# Altium schematic sheet Quadrature Mixers [FIXED].SchDoc
size A; SheetNumber: 6; SheetTotal: 6
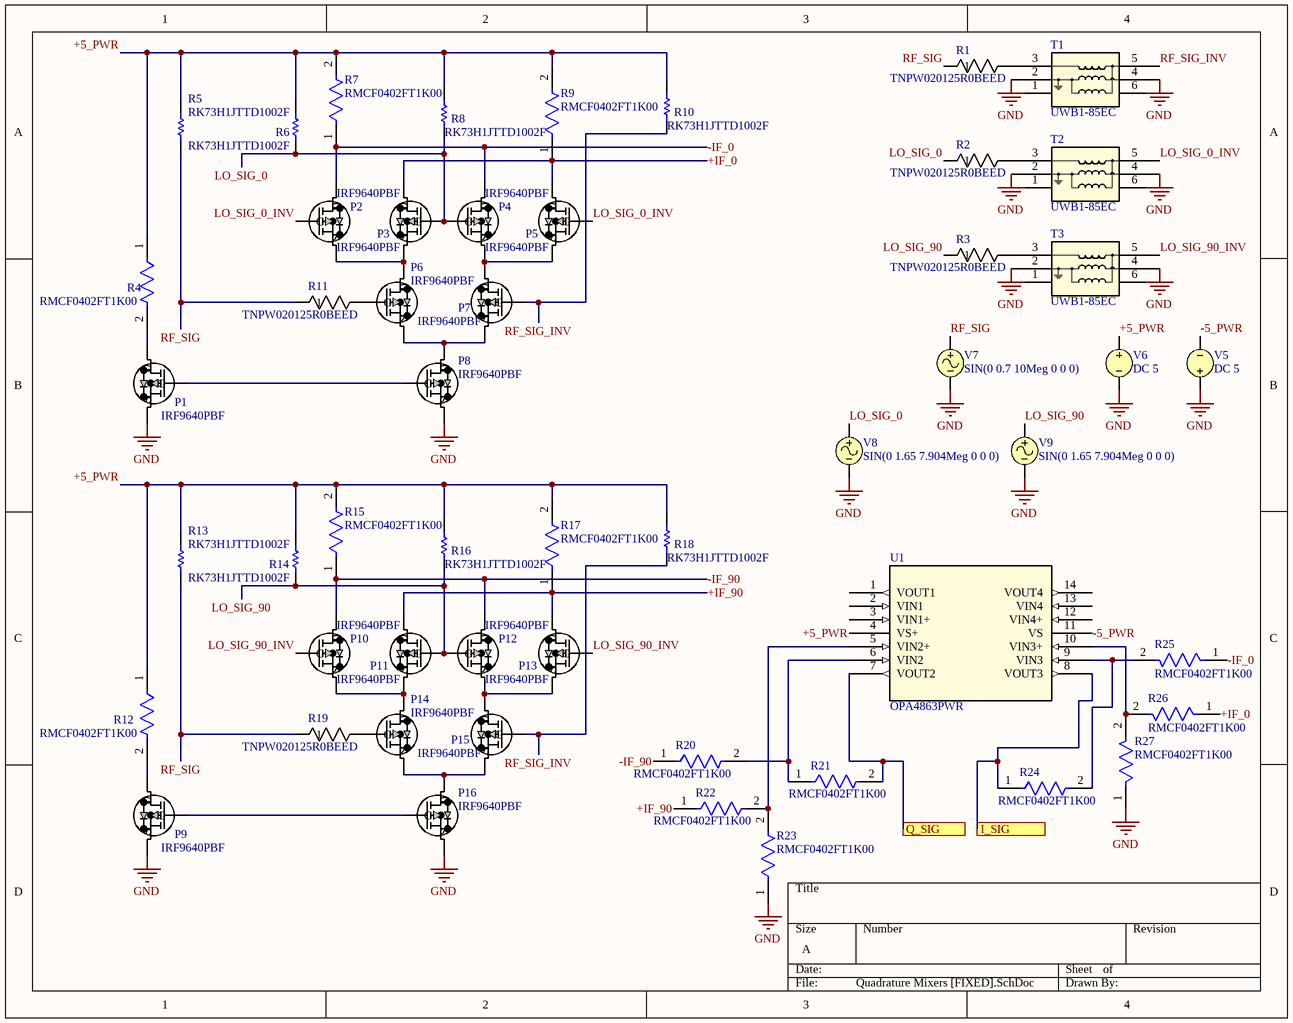
[diagram p0: Quadrature Mixers [FIXED].SchDoc]

## Parts
P1  IRF9640PBF  [TO220AB_VIS]
P2  IRF9640PBF  [TO220AB_VIS]
P3  IRF9640PBF  [TO220AB_VIS]
P4  IRF9640PBF  [TO220AB_VIS]
P5  IRF9640PBF  [TO220AB_VIS]
P6  IRF9640PBF  [TO220AB_VIS]
P7  IRF9640PBF  [TO220AB_VIS]
P8  IRF9640PBF  [TO220AB_VIS]
P9  IRF9640PBF  [TO220AB_VIS]
P10  IRF9640PBF  [TO220AB_VIS]
P11  IRF9640PBF  [TO220AB_VIS]
P12  IRF9640PBF  [TO220AB_VIS]
P13  IRF9640PBF  [TO220AB_VIS]
P14  IRF9640PBF  [TO220AB_VIS]
P15  IRF9640PBF  [TO220AB_VIS]
P16  IRF9640PBF  [TO220AB_VIS]
R1  TNPW020125R0BEED  [RES_TNPW0201_VIS]
R2  TNPW020125R0BEED  [RES_TNPW0201_VIS]
R3  TNPW020125R0BEED  [RES_TNPW0201_VIS]
R4  RMCF0402FT1K00  [FP-RMCF0402-MFG]
R5  RK73H1JTTD1002F  [RESC1608X55X30ML20T10]
R6  RK73H1JTTD1002F  [RESC1608X55X30ML20T10]
R7  RMCF0402FT1K00  [FP-RMCF0402-MFG]
R8  RK73H1JTTD1002F  [RESC1608X55X30ML20T10]
R9  RMCF0402FT1K00  [FP-RMCF0402-MFG]
R10  RK73H1JTTD1002F  [RESC1608X55X30ML20T10]
R11  TNPW020125R0BEED  [RES_TNPW0201_VIS]
R12  RMCF0402FT1K00  [FP-RMCF0402-MFG]
R13  RK73H1JTTD1002F  [RESC1608X55X30ML20T10]
R14  RK73H1JTTD1002F  [RESC1608X55X30ML20T10]
R15  RMCF0402FT1K00  [FP-RMCF0402-MFG]
R16  RK73H1JTTD1002F  [RESC1608X55X30ML20T10]
R17  RMCF0402FT1K00  [FP-RMCF0402-MFG]
R18  RK73H1JTTD1002F  [RESC1608X55X30ML20T10]
R19  TNPW020125R0BEED  [RES_TNPW0201_VIS]
R20  RMCF0402FT1K00  [FP-RMCF0402-MFG]
R21  RMCF0402FT1K00  [FP-RMCF0402-MFG]
R22  RMCF0402FT1K00  [FP-RMCF0402-MFG]
R23  RMCF0402FT1K00  [FP-RMCF0402-MFG]
R24  RMCF0402FT1K00  [FP-RMCF0402-MFG]
R25  RMCF0402FT1K00  [FP-RMCF0402-MFG]
R26  RMCF0402FT1K00  [FP-RMCF0402-MFG]
R27  RMCF0402FT1K00  [FP-RMCF0402-MFG]
T1  UWB1-85EC  [UWB1UWB2_COC]
T2  UWB1-85EC  [UWB1UWB2_COC]
T3  UWB1-85EC  [UWB1UWB2_COC]
U1  OPA4863PWR  [PW14_TEX]
V5  DC 5
V6  DC 5
V7  SIN(0 0.7 10Meg 0 0 0)
V8  SIN(0 1.65 7.904Meg 0 0 0)
V9  SIN(0 1.65 7.904Meg 0 0 0)

## Ports
I_SIG, Q_SIG

## Nets
GND: P1.3(S) P8.3(S) P9.3(S) P16.3(S) R23.1 R27.1 T1.2 T1.4 T2.2 T2.4 T3.2 T3.4 V5.1 V6.2 V7.2 V8.2 V9.2
+5_PWR: R4.1 R5.2 R6.2 R7.2 R8.2 R9.2 R10.2 R12.1 R13.2 R14.2 R15.2 R16.2 R17.2 R18.2 U1.4(VS+) V6.1
+IF_0: P3.2(D) P5.2(D) R9.1 R26.1
+IF_90: P11.2(D) P13.2(D) R17.1 R22.1
-5_PWR: U1.11(VS) V5.2
-IF_0: P2.2(D) P4.2(D) R7.1 R25.1
-IF_90: P10.2(D) P12.2(D) R15.1 R20.1
I_SIG: R24.1 U1.8(VOUT3) ; port I_SIG
LO_SIG_0: P3.1(G) P4.1(G) R2.1 R6.1 R8.1 V8.1
LO_SIG_0_INV: P2.1(G) P5.1(G) T2.5
LO_SIG_90: P11.1(G) P12.1(G) R3.1 R14.1 R16.1 V9.1
LO_SIG_90_INV: P10.1(G) P13.1(G) T3.5
Q_SIG: R21.2 U1.7(VOUT2) ; port Q_SIG
RF_SIG: R1.1 R5.1 R11.1 R13.1 R19.1 V7.1
RF_SIG_INV: P7.1(G) P15.1(G) R10.1 R18.1 T1.5
NetP1_1: P1.1(G) P8.1(G)
NetP1_2: P1.2(D) R4.2
NetP2_3: P2.3(S) P3.3(S) P6.2(D)
NetP4_3: P4.3(S) P5.3(S) P7.2(D)
NetP6_1: P6.1(G) R11.2
NetP6_3: P6.3(S) P7.3(S) P8.2(D)
NetP9_1: P9.1(G) P16.1(G)
NetP9_2: P9.2(D) R12.2
NetP10_3: P10.3(S) P11.3(S) P14.2(D)
NetP12_3: P12.3(S) P13.3(S) P15.2(D)
NetP14_1: P14.1(G) R19.2
NetP14_3: P14.3(S) P15.3(S) P16.2(D)
NetR1_2: R1.2 T1.3
NetR2_2: R2.2 T2.3
NetR3_2: R3.2 T3.3
NetR20_2: R20.2 R21.1 U1.6(VIN2)
NetR22_2: R22.2 R23.2 U1.5(VIN2+)
NetR24_2: R24.2 R25.2 U1.9(VIN3)
NetR26_2: R26.2 R27.2 U1.10(VIN3+)

Not connected (* = marked no-connect by the designer): T1 1 6; T2 1 6; T3 1 6; U1 1(VOUT1) 2(VIN1) 3(VIN1+) 12(VIN4+) 13(VIN4) 14(VOUT4)

## Library data of the parts
P1-P16 = IRF9640PBF: No Description Available; Mfr_Name: Vishay
R1-R3 R11 R19 = TNPW020125R0BEED: RES 25 OHM 0.1% 0.075W 0201; Mfr_Name: Vishay
R4 R7 R9 R12 R15 R17 R20-R27 = CMP-26527-000026-1: 1kΩ ±1% 0.063W 0402 Thick Film Chip Resistor AEC-Q200 compliant; Resistance: 1kR; Temperature Coefficient: 100ppm/°C; Power Rating: 63mW; Length: 1mm; RoHS Compliant: Yes; Construction: Rectangular; Height: 0.016inch; Size Code: 0402; Lead Free: Lead Free; Radiation Hardening: No; Tolerance: 1%; Width: 0.02inch; Military Standard: Not; Resistor Type: Thick Film; Number of Terminations: 2; Min Operating Temperature: -55°C; Max Operating Temperature: 155°C; Depth: 0.5mm; Features: Automotive AEC-Q200; Packaging: Tape and Reel; Case Code (Metric): 1005; Mount: Surface Mount; Contact Plating: Tin; Max Power Dissipation: 63mW; Case/Package: 0402; Case Code (Imperial): 0402; Series: RMCF
R5 R6 R8 R10 R13 R14 R16 R18 = CMP-2000-01099-1: Manufacturer: KOA Speer; Part Number: RK73H1JTTD1002F
T1-T3 = UWB1-85EC: • 3 dB bandwidth: 1 MHz to 8.5 GHz • 1/4 Watt RF input power • 250 mA max current rating • AEC-Q200 Grade 1 (–40°C to +125°C); Mfr_Name: Coilcraft; RefDes: RefDes; Type: Type
U1 = OPA4863PWR: No Description Available; Mfr_Name: Texas Instruments; Type: Linear; RefDes: RefDes
V5 V6 = VSRC: Voltage Source; Note: PCB Footprint - Not required; AC Magnitude: 1; AC Phase: 0; Value: 5; Published: 8-Jun-2000; LatestRevisionDate: 17-Jul-2002; LatestRevisionNote: Re-released for DXP Platform.; PackageReference: Not Applicable; Publisher: Altium Limited
V7 = VSIN: Sinusoidal Voltage Source; Note: PCB Footprint - Not required; Offset: 0; Amplitude: 0.7; AC Magnitude: 1; Published: 8-Jun-2000; LatestRevisionDate: 15-Nov-2004; LatestRevisionNote: Corrected Netlist.; PackageReference: Not Applicable; Publisher: Altium Limited; Frequency: 10Meg; Delay: 0; Damping Factor: 0; Phase: 0; DC Magnitude: 0; AC Phase: 0
V8 = VSIN: Sinusoidal Voltage Source; Note: PCB Footprint - Not required; Offset: 0; Amplitude: 1.65; AC Magnitude: 1; Published: 8-Jun-2000; LatestRevisionDate: 15-Nov-2004; LatestRevisionNote: Corrected Netlist.; PackageReference: Not Applicable; Publisher: Altium Limited; Frequency: 7.904Meg; Delay: 0; Damping Factor: 0; Phase: 0; DC Magnitude: 0; AC Phase: 0
V9 = VSIN: Sinusoidal Voltage Source; Note: PCB Footprint - Not required; Offset: 0; Amplitude: 1.65; AC Magnitude: 1; AC Phase: 90; Published: 8-Jun-2000; LatestRevisionDate: 15-Nov-2004; LatestRevisionNote: Corrected Netlist.; PackageReference: Not Applicable; Publisher: Altium Limited; Frequency: 7.904Meg; Delay: 0; Damping Factor: 0; Phase: 0; DC Magnitude: 0